# Altium schematic sheet Smart Grid Schematic.SchDoc
size A
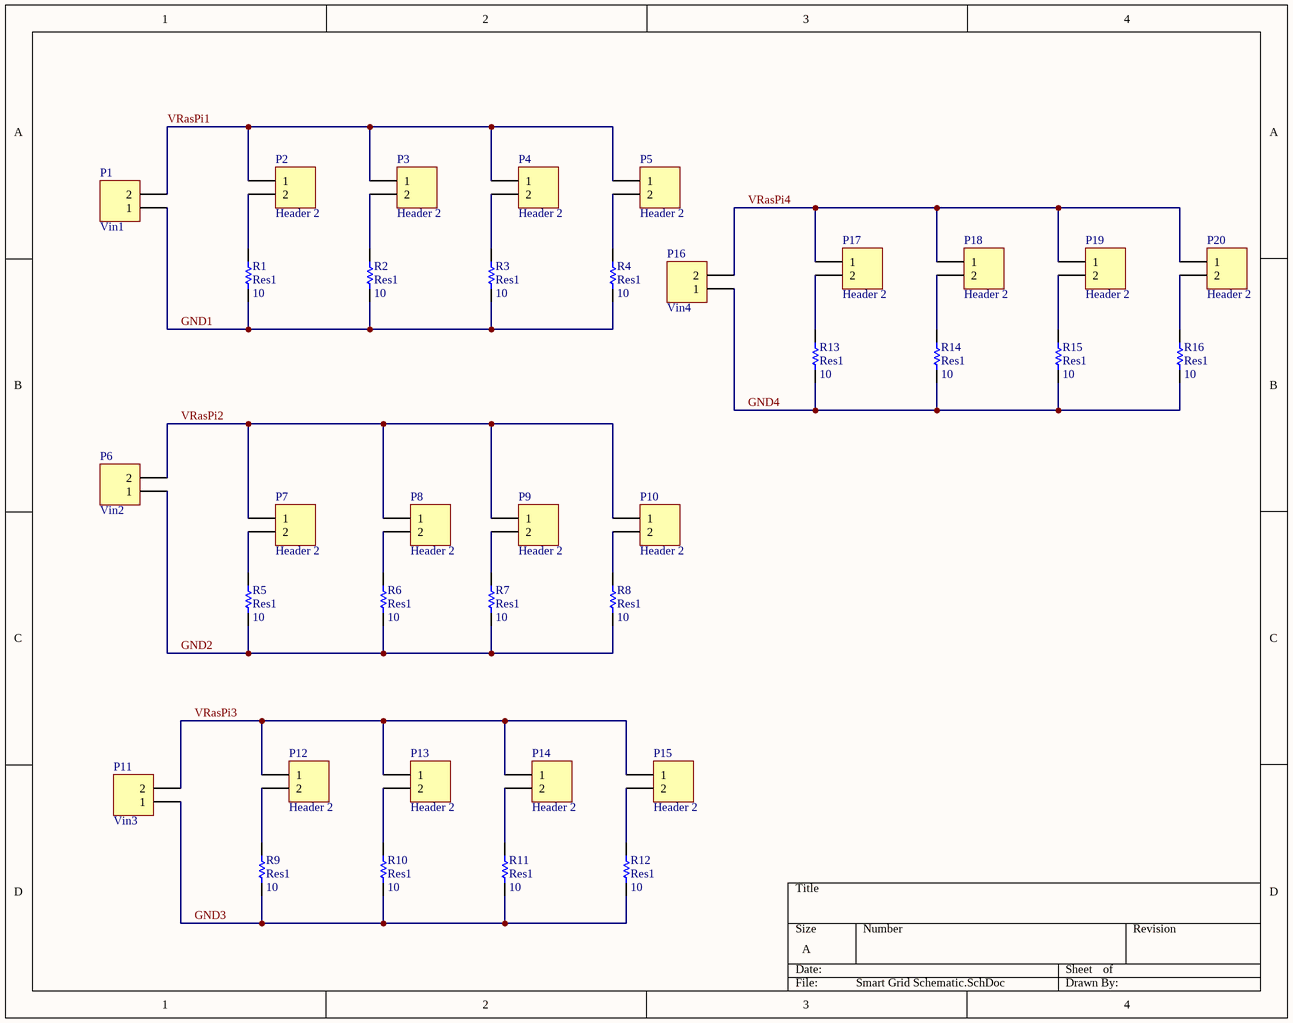
[diagram p0: Smart Grid Schematic.SchDoc]

## Parts
P1  Vin1  [HDR1X2]
P2  Header 2  [HDR1X2]
P3  Header 2  [HDR1X2]
P4  Header 2  [HDR1X2]
P5  Header 2  [HDR1X2]
P6  Vin2  [HDR1X2]
P7  Header 2  [HDR1X2]
P8  Header 2  [HDR1X2]
P9  Header 2  [HDR1X2]
P10  Header 2  [HDR1X2]
P11  Vin3  [HDR1X2]
P12  Header 2  [HDR1X2]
P13  Header 2  [HDR1X2]
P14  Header 2  [HDR1X2]
P15  Header 2  [HDR1X2]
P16  Vin4  [HDR1X2]
P17  Header 2  [HDR1X2]
P18  Header 2  [HDR1X2]
P19  Header 2  [HDR1X2]
P20  Header 2  [HDR1X2]
R1  Res1  value 10  [AXIAL-0.3]
R2  Res1  value 10  [AXIAL-0.3]
R3  Res1  value 10  [AXIAL-0.3]
R4  Res1  value 10  [AXIAL-0.3]
R5  Res1  value 10  [AXIAL-0.3]
R6  Res1  value 10  [AXIAL-0.3]
R7  Res1  value 10  [AXIAL-0.3]
R8  Res1  value 10  [AXIAL-0.3]
R9  Res1  value 10  [AXIAL-0.3]
R10  Res1  value 10  [AXIAL-0.3]
R11  Res1  value 10  [AXIAL-0.3]
R12  Res1  value 10  [AXIAL-0.3]
R13  Res1  value 10  [AXIAL-0.3]
R14  Res1  value 10  [AXIAL-0.3]
R15  Res1  value 10  [AXIAL-0.3]
R16  Res1  value 10  [AXIAL-0.3]

## Nets
GND1: P1.1 R1.1 R2.1 R3.1 R4.1
GND2: P6.1 R5.1 R6.1 R7.1 R8.1
GND3: P11.1 R9.1 R10.1 R11.1 R12.1
GND4: P16.1 R13.1 R14.1 R15.1 R16.1
VRasPi1: P1.2 P2.1 P3.1 P4.1 P5.1
VRasPi2: P6.2 P7.1 P8.1 P9.1 P10.1
VRasPi3: P11.2 P12.1 P13.1 P14.1 P15.1
VRasPi4: P16.2 P17.1 P18.1 P19.1 P20.1
NetP2_2: P2.2 R1.2
NetP3_2: P3.2 R2.2
NetP4_2: P4.2 R3.2
NetP5_2: P5.2 R4.2
NetP7_2: P7.2 R5.2
NetP8_2: P8.2 R6.2
NetP9_2: P9.2 R7.2
NetP10_2: P10.2 R8.2
NetP12_2: P12.2 R9.2
NetP13_2: P13.2 R10.2
NetP14_2: P14.2 R11.2
NetP15_2: P15.2 R12.2
NetP17_2: P17.2 R13.2
NetP18_2: P18.2 R14.2
NetP19_2: P19.2 R15.2
NetP20_2: P20.2 R16.2

## Library data of the parts
P1-P20 = Header 2: Header, 2-Pin; LatestRevisionDate: 17-Jul-2002; LatestRevisionNote: Re-released for DXP Platform.; Publisher: Altium Limited
R1-R16 = Res1: Resistor; Published: 8-Jun-2000; LatestRevisionDate: 17-Jul-2002; LatestRevisionNote: Re-released for DXP Platform.; PackageReference: AXIAL-0.3; Publisher: Altium Limited; PackageDescription: Axial Device, Thru-Hole; 2 Leads; 0.3 in Pin Spacing